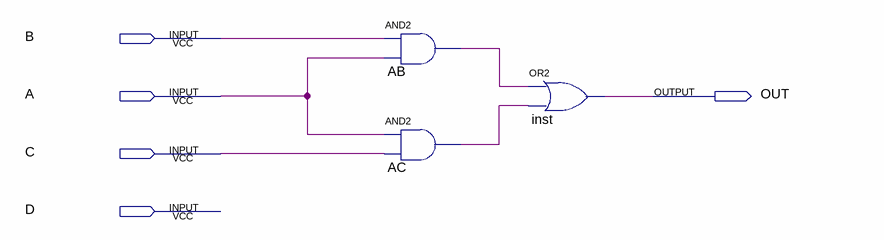
[diagram p0: schematic sheet]
// Quartus schematic calcular_decenas.bdf as structural Verilog: 3 symbols, 5 pins
module calcular_decenas (
  input  B,
  input  A,
  input  C,
  input  D,
  output OUT
);

  wire AB_out, AC_out;

  and AB (AB_out, B, A);
  and AC (AC_out, A, C);
  or inst (OUT, AB_out, AC_out);
endmodule
